# Altium project PCB_Project1.PrjPCB
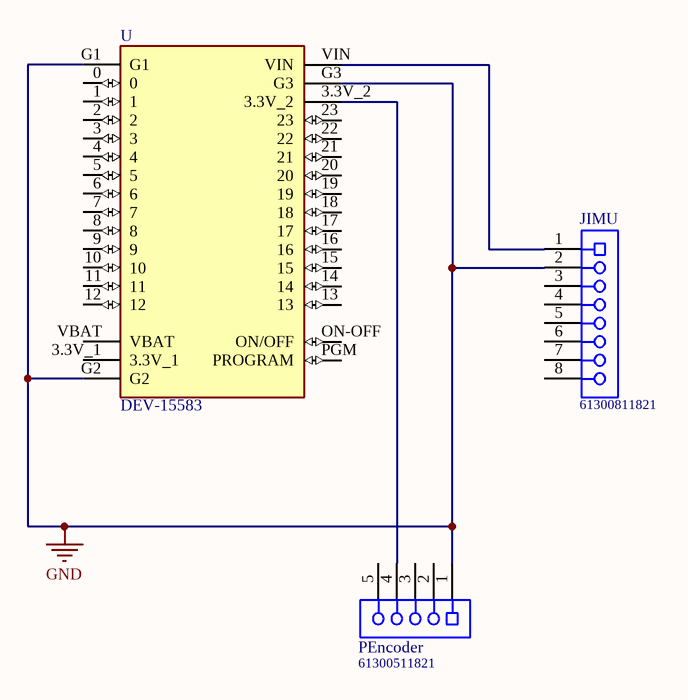
[diagram p0: Sheet1.SchDoc]
1 sheet, 3 parts. Net scope: global (net labels, ports and power ports of the same name join across sheets).
Board file: PCB1.PcbDoc

## Sheet Sheet1.SchDoc
size A4

### Parts
JIMU  61300811821  [61300811821]
PEncoder  61300511821  [61300511821]
U  DEV-15583  [MODULE_DEV-15583]

### Nets
GND: JIMU.2 PEncoder.1 U.G1 U.G2 U.G3
NetJIMU_1: JIMU.1 U.VIN
NetPEncoder_4: PEncoder.4 U.3.3V_2

Not connected (* = marked no-connect by the designer): JIMU 3 4 5 6 7 8; PEncoder 2 3 5; U 0 1 2 3 3.3V_1 4 5 6 7 8 9 10 11 12 13 14 15 16 17 18 19 20 21 22 23 ON-OFF(ON/OFF) PGM(PROGRAM) VBAT

### Library data of the parts
JIMU = CMP-1502-01327-1: THT Vertical Socket Header WR-PHD, Pitch 2.54 mm, Single Row, 8 pins; Manufacturer: Wurth Elektronik; Gender: Female; Pin Number: 8; Withstanding Voltage: 500VAC; Pitch: 2.54mm; Contact Resistance: 20mOhm; Working Voltage: 250VAC; Rated Current: 3A; Mounting Technology: THT; Manufacturer URL: http://www.we-online.de; Package Reference: 61300811821; Orientation: Vertical; Datasheet URL: https://katalog.we-online.de/em/datasheet/6130xx11821.pdf; Row Number: Single; Packaging: Tray; Part Number: 61300811821; Publisher: WurthElektronik; Operating Temperature: -40to125degC
PEncoder = CMP-1502-01320-1: THT Vertical Socket Header WR-PHD, Pitch 2.54 mm, Single Row, 5 pins; Manufacturer: Wurth Elektronik; Contact Resistance: 20mOhm; Rated Current: 3A; Working Voltage: 250VAC; Gender: Female; Pin Number: 5; Pitch: 2.54mm; Withstanding Voltage: 500VAC; Row Number: Single; Part Number: 61300511821; Package Reference: 61300511821; Publisher: WurthElektronik; Datasheet URL: https://katalog.we-online.de/em/datasheet/6130xx11821.pdf; Orientation: Vertical; Manufacturer URL: http://www.we-online.de; Mounting Technology: THT; Operating Temperature: -40to125degC; Packaging: Tray
U = DEV-15583: RT1062 Teensy 4.0 i.MX ARMÂ® CortexÂ®-M7 MPU Embedded Evaluation Board; MF: SparkFun Electronics; Value: *; Package: None; Digi-Key_Part_Number: 1568-DEV-15583-ND; Digi-Key_Purchase_URL: https://www.digikey.com/product-detail/en/sparkfun-electronics/DEV-15583/1568-DEV-15583-ND/10384551?utm_source=snapeda&utm_medium=aggregator&utm_campaign=symbol; MP: DEV-15583; SnapEDA_Link: https://www.snapeda.com/parts/DEV-15583/SparkFun%20Electronics/view-part/4001229/?ref=snap